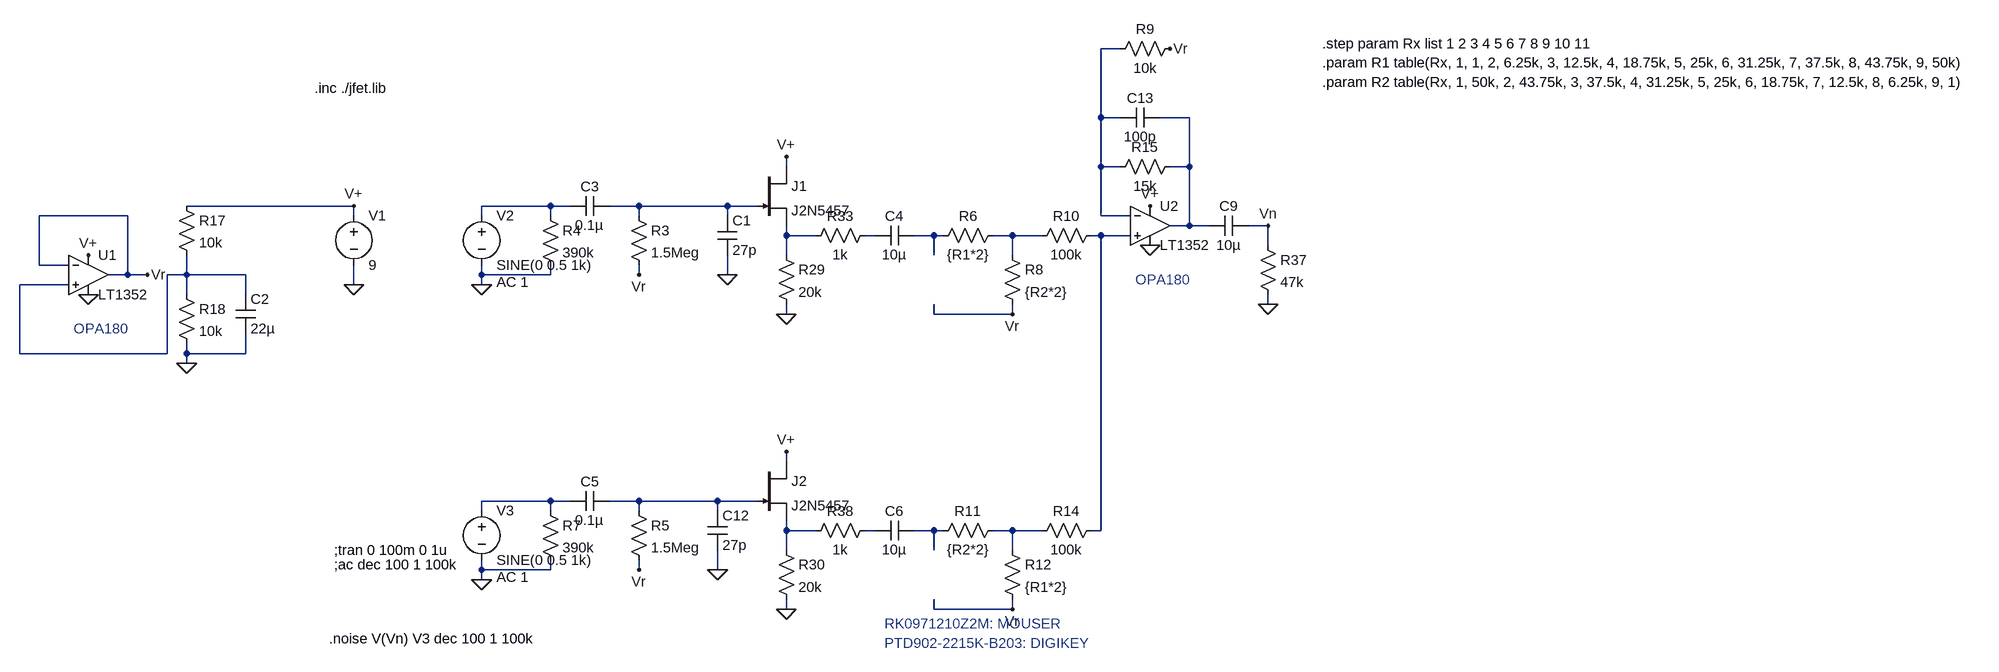
[diagram p0: schematic CB_BGP_BLEND.asc]
CB_BGP_BLEND.asc, the LTspice schematic file:
Version 4
SHEET 1 5112 4608
WIRE 1424 -192 1392 -192
WIRE 1392 -80 1392 -192
WIRE 1424 -80 1392 -80
WIRE 1536 -80 1488 -80
WIRE 880 0 880 -16
WIRE 1392 0 1392 -80
WIRE 1424 0 1392 0
WIRE 1536 0 1536 -80
WIRE 1536 0 1504 0
WIRE 176 64 -96 64
WIRE 496 64 384 64
WIRE 528 64 496 64
WIRE 640 64 592 64
WIRE 784 64 640 64
WIRE 832 64 784 64
WIRE -192 80 -336 80
WIRE 176 80 176 64
WIRE 384 80 384 64
WIRE 496 80 496 64
WIRE 640 80 640 64
WIRE 784 80 784 64
WIRE 1392 80 1392 0
WIRE 1440 80 1392 80
WIRE 1536 96 1536 0
WIRE 1536 96 1504 96
WIRE 1568 96 1536 96
WIRE 1664 96 1632 96
WIRE 880 112 880 96
WIRE 928 112 880 112
WIRE 1024 112 1008 112
WIRE 1120 112 1088 112
WIRE 1136 112 1120 112
WIRE 1248 112 1216 112
WIRE 1296 112 1248 112
WIRE 1392 112 1376 112
WIRE 1440 112 1392 112
WIRE 1664 128 1664 96
WIRE 880 144 880 112
WIRE 1120 144 1120 112
WIRE 1248 144 1248 112
WIRE -336 160 -336 80
WIRE -288 160 -336 160
WIRE -192 176 -192 80
WIRE -192 176 -224 176
WIRE -160 176 -192 176
WIRE -96 176 -96 144
WIRE -96 176 -128 176
WIRE 0 176 -96 176
WIRE 384 176 384 160
WIRE 496 176 496 160
WIRE 496 176 384 176
WIRE 640 176 640 160
WIRE 784 176 784 144
WIRE -288 192 -368 192
WIRE 176 192 176 160
WIRE 384 192 384 176
WIRE -96 208 -96 176
WIRE 0 208 0 176
WIRE 1664 224 1664 208
WIRE 880 240 880 224
WIRE 1120 240 1120 224
WIRE 1248 240 1248 224
WIRE 1248 240 1120 240
WIRE -368 304 -368 192
WIRE -128 304 -128 176
WIRE -128 304 -368 304
WIRE -96 304 -96 288
WIRE 0 304 0 272
WIRE 0 304 -96 304
WIRE -96 320 -96 304
WIRE 880 480 880 464
WIRE 496 544 384 544
WIRE 528 544 496 544
WIRE 640 544 592 544
WIRE 768 544 640 544
WIRE 832 544 768 544
WIRE 384 560 384 544
WIRE 496 560 496 544
WIRE 640 560 640 544
WIRE 768 560 768 544
WIRE 880 592 880 576
WIRE 928 592 880 592
WIRE 1024 592 1008 592
WIRE 1120 592 1088 592
WIRE 1136 592 1120 592
WIRE 1248 592 1216 592
WIRE 1296 592 1248 592
WIRE 1392 592 1392 112
WIRE 1392 592 1376 592
WIRE 880 624 880 592
WIRE 1120 624 1120 592
WIRE 1248 624 1248 592
WIRE 384 656 384 640
WIRE 496 656 496 640
WIRE 496 656 384 656
WIRE 640 656 640 640
WIRE 768 656 768 624
WIRE 384 672 384 656
WIRE 880 720 880 704
WIRE 1120 720 1120 704
WIRE 1248 720 1248 704
WIRE 1248 720 1120 720
FLAG 384 192 0
FLAG 880 -16 V+
FLAG 384 672 0
FLAG 880 464 V+
FLAG 1472 64 V+
FLAG 176 64 V+
FLAG 176 192 0
FLAG 784 176 0
FLAG 880 240 0
FLAG 880 720 0
FLAG -96 320 0
FLAG -256 144 V+
FLAG -160 176 Vr
FLAG 640 656 Vr
FLAG 1248 720 Vr
FLAG 640 176 Vr
FLAG 1248 240 Vr
FLAG -256 208 0
FLAG 1472 128 0
FLAG 768 656 0
FLAG 1504 -192 Vr
FLAG 1664 224 0
FLAG 1664 96 Vn
SYMBOL voltage 176 64 R0
WINDOW 123 0 0 Left 2
WINDOW 39 0 0 Left 2
SYMATTR InstName V1
SYMATTR Value 9
SYMBOL voltage 384 64 R0
WINDOW 123 24 124 Left 2
WINDOW 39 0 0 Left 2
SYMATTR Value2 AC 1
SYMATTR InstName V2
SYMATTR Value SINE(0 0.5 1k)
SYMBOL res 624 64 R0
SYMATTR InstName R3
SYMATTR Value 1.5Meg
SYMBOL res 480 64 R0
SYMATTR InstName R4
SYMATTR Value 390k
SYMBOL cap 592 48 R90
WINDOW 0 0 32 VBottom 2
WINDOW 3 32 32 VTop 2
SYMATTR InstName C3
SYMATTR Value 0.1µ
SYMBOL njf 832 0 R0
SYMATTR InstName J1
SYMATTR Value J2N5457
SYMBOL cap 1088 96 R90
WINDOW 0 0 32 VBottom 2
WINDOW 3 32 32 VTop 2
SYMATTR InstName C4
SYMATTR Value 10µ
SYMBOL voltage 384 544 R0
WINDOW 123 24 124 Left 2
WINDOW 39 0 0 Left 2
SYMATTR Value2 AC 1
SYMATTR InstName V3
SYMATTR Value SINE(0 0.5 1k)
SYMBOL res 624 544 R0
SYMATTR InstName R5
SYMATTR Value 1.5Meg
SYMBOL res 480 544 R0
SYMATTR InstName R7
SYMATTR Value 390k
SYMBOL cap 592 528 R90
WINDOW 0 0 32 VBottom 2
WINDOW 3 32 32 VTop 2
SYMATTR InstName C5
SYMATTR Value 0.1µ
SYMBOL njf 832 480 R0
SYMATTR InstName J2
SYMATTR Value J2N5457
SYMBOL cap 1088 576 R90
WINDOW 0 0 32 VBottom 2
WINDOW 3 32 32 VTop 2
SYMATTR InstName C6
SYMATTR Value 10µ
SYMBOL res 1232 96 R90
WINDOW 0 0 56 VBottom 2
WINDOW 3 32 56 VTop 2
SYMATTR InstName R6
SYMATTR Value {R1*2}
SYMBOL res 1232 128 R0
SYMATTR InstName R8
SYMATTR Value {R2*2}
SYMBOL res 1392 96 R90
WINDOW 0 0 56 VBottom 2
WINDOW 3 32 56 VTop 2
SYMATTR InstName R10
SYMATTR Value 100k
SYMBOL res 1232 576 R90
WINDOW 0 0 56 VBottom 2
WINDOW 3 32 56 VTop 2
SYMATTR InstName R11
SYMATTR Value {R2*2}
SYMBOL res 1232 608 R0
SYMATTR InstName R12
SYMATTR Value {R1*2}
SYMBOL res 1392 576 R90
WINDOW 0 0 56 VBottom 2
WINDOW 3 32 56 VTop 2
SYMATTR InstName R14
SYMATTR Value 100k
SYMBOL res 1520 -16 R90
WINDOW 0 0 56 VBottom 2
WINDOW 3 32 56 VTop 2
SYMATTR InstName R15
SYMATTR Value 15k
SYMBOL cap 1632 80 R90
WINDOW 0 0 32 VBottom 2
WINDOW 3 32 32 VTop 2
SYMATTR InstName C9
SYMATTR Value 10µ
SYMBOL res 1648 112 R0
SYMATTR InstName R37
SYMATTR Value 47k
SYMBOL cap 768 80 R0
SYMATTR InstName C1
SYMATTR Value 27p
SYMBOL res 864 608 R0
SYMATTR InstName R30
SYMATTR Value 20k
SYMBOL res -112 48 R0
SYMATTR InstName R17
SYMATTR Value 10k
SYMBOL res -112 192 R0
SYMATTR InstName R18
SYMATTR Value 10k
SYMBOL cap -16 208 R0
SYMATTR InstName C2
SYMATTR Value 22µ
SYMBOL res 864 128 R0
SYMATTR InstName R29
SYMATTR Value 20k
SYMBOL cap 752 560 R0
SYMATTR InstName C12
SYMATTR Value 27p
SYMBOL res 1024 96 R90
WINDOW 0 0 56 VBottom 2
WINDOW 3 32 56 VTop 2
SYMATTR InstName R33
SYMATTR Value 1k
SYMBOL res 1024 576 R90
WINDOW 0 0 56 VBottom 2
WINDOW 3 32 56 VTop 2
SYMATTR InstName R38
SYMATTR Value 1k
SYMBOL cap 1488 -96 R90
WINDOW 0 0 32 VBottom 2
WINDOW 3 32 32 VTop 2
SYMATTR InstName C13
SYMATTR Value 100p
SYMBOL Opamps\\LT1352 -256 112 R0
SYMATTR InstName U1
SYMBOL Opamps\\LT1352 1472 32 R0
SYMATTR InstName U2
SYMBOL res 1520 -208 R90
WINDOW 0 0 56 VBottom 2
WINDOW 3 32 56 VTop 2
SYMATTR InstName R9
SYMATTR Value 10k
TEXT 112 -128 Left 2 !.inc ./jfet.lib
TEXT 144 624 Left 2 !;tran 0 100m 0 1u
TEXT 144 648 Left 2 !;ac dec 100 1 100k
TEXT 1448 184 Left 2 ;OPA180
TEXT 1040 744 Left 2 ;RK0971210Z2M: MOUSER\nPTD902-2215K-B203: DIGIKEY
TEXT 1752 -200 Left 2 !.step param Rx list 1 2 3 4 5 6 7 8 9 10 11\n.param R1 table(Rx, 1, 1, 2, 6.25k, 3, 12.5k, 4, 18.75k, 5, 25k, 6, 31.25k, 7, 37.5k, 8, 43.75k, 9, 50k)\n.param R2 table(Rx, 1, 50k, 2, 43.75k, 3, 37.5k, 4, 31.25k, 5, 25k, 6, 18.75k, 7, 12.5k, 8, 6.25k, 9, 1)
TEXT 136 768 Left 2 !.noise V(Vn) V3 dec 100 1 100k
TEXT -280 264 Left 2 ;OPA180

The netlist it stands for:
* CB_BGP_BLEND.asc
V1 V+ 0 9
V2 N003 0 SINE(0 0.5 1k) AC 1
R3 N004 Vr 1.5Meg
R4 N003 0 390k
C3 N004 N003 0.1µ
J1 V+ N004 N005 J2N5457
C4 N007 N006 10µ
V3 N011 0 SINE(0 0.5 1k) AC 1
R5 N012 Vr 1.5Meg
R7 N011 0 390k
C5 N012 N011 0.1µ
J2 V+ N012 N013 J2N5457
C6 N015 N014 10µ
R6 N008 N007 {R1*2}
R8 N008 Vr {R2*2}
R10 N009 N008 100k
R11 N016 N015 {R2*2}
R12 N016 Vr {R1*2}
R14 N009 N016 100k
R15 N002 N001 15k
C9 Vn N002 10µ
R37 Vn 0 47k
C1 N004 0 27p
R30 N013 0 20k
R17 V+ N010 10k
R18 N010 0 10k
C2 N010 0 22µ
R29 N005 0 20k
C12 N012 0 27p
R33 N006 N005 1k
R38 N014 N013 1k
C13 N002 N001 100p
XU1 N010 Vr V+ 0 Vr LT1352  ; pins In+ In- V+ V- OUT
XU2 N009 N001 V+ 0 N002 LT1352  ; pins In+ In- V+ V- OUT
R9 Vr N001 10k
.model NJF NJF
.model PJF PJF
.lib standard.jft
.inc ./jfet.lib
;tran 0 100m 0 1u
;ac dec 100 1 100k
* OPA180
* RK0971210Z2M: MOUSER
* PTD902-2215K-B203: DIGIKEY
.step param Rx list 1 2 3 4 5 6 7 8 9 10 11
.param R1 table(Rx, 1, 1, 2, 6.25k, 3, 12.5k, 4, 18.75k, 5, 25k, 6, 31.25k, 7, 37.5k, 8, 43.75k, 9, 50k)
.param R2 table(Rx, 1, 50k, 2, 43.75k, 3, 37.5k, 4, 31.25k, 5, 25k, 6, 18.75k, 7, 12.5k, 8, 6.25k, 9, 1)
.noise V(Vn) V3 dec 100 1 100k
* OPA180
.lib LTC.lib
.backanno
.end